# EasyEDA Pro project sata-3.3v-injector.eprj

# Schematic Schematic1
Board Name: Board1; Create Date: 2025-01-10; Page Name: P1; Project Name: sata-3.3v-injectior; Schematic Name: Schematic1; Update Date: 2025-01-11; Company: EasyEDA.com; Page Size: A4; Version: V1.0
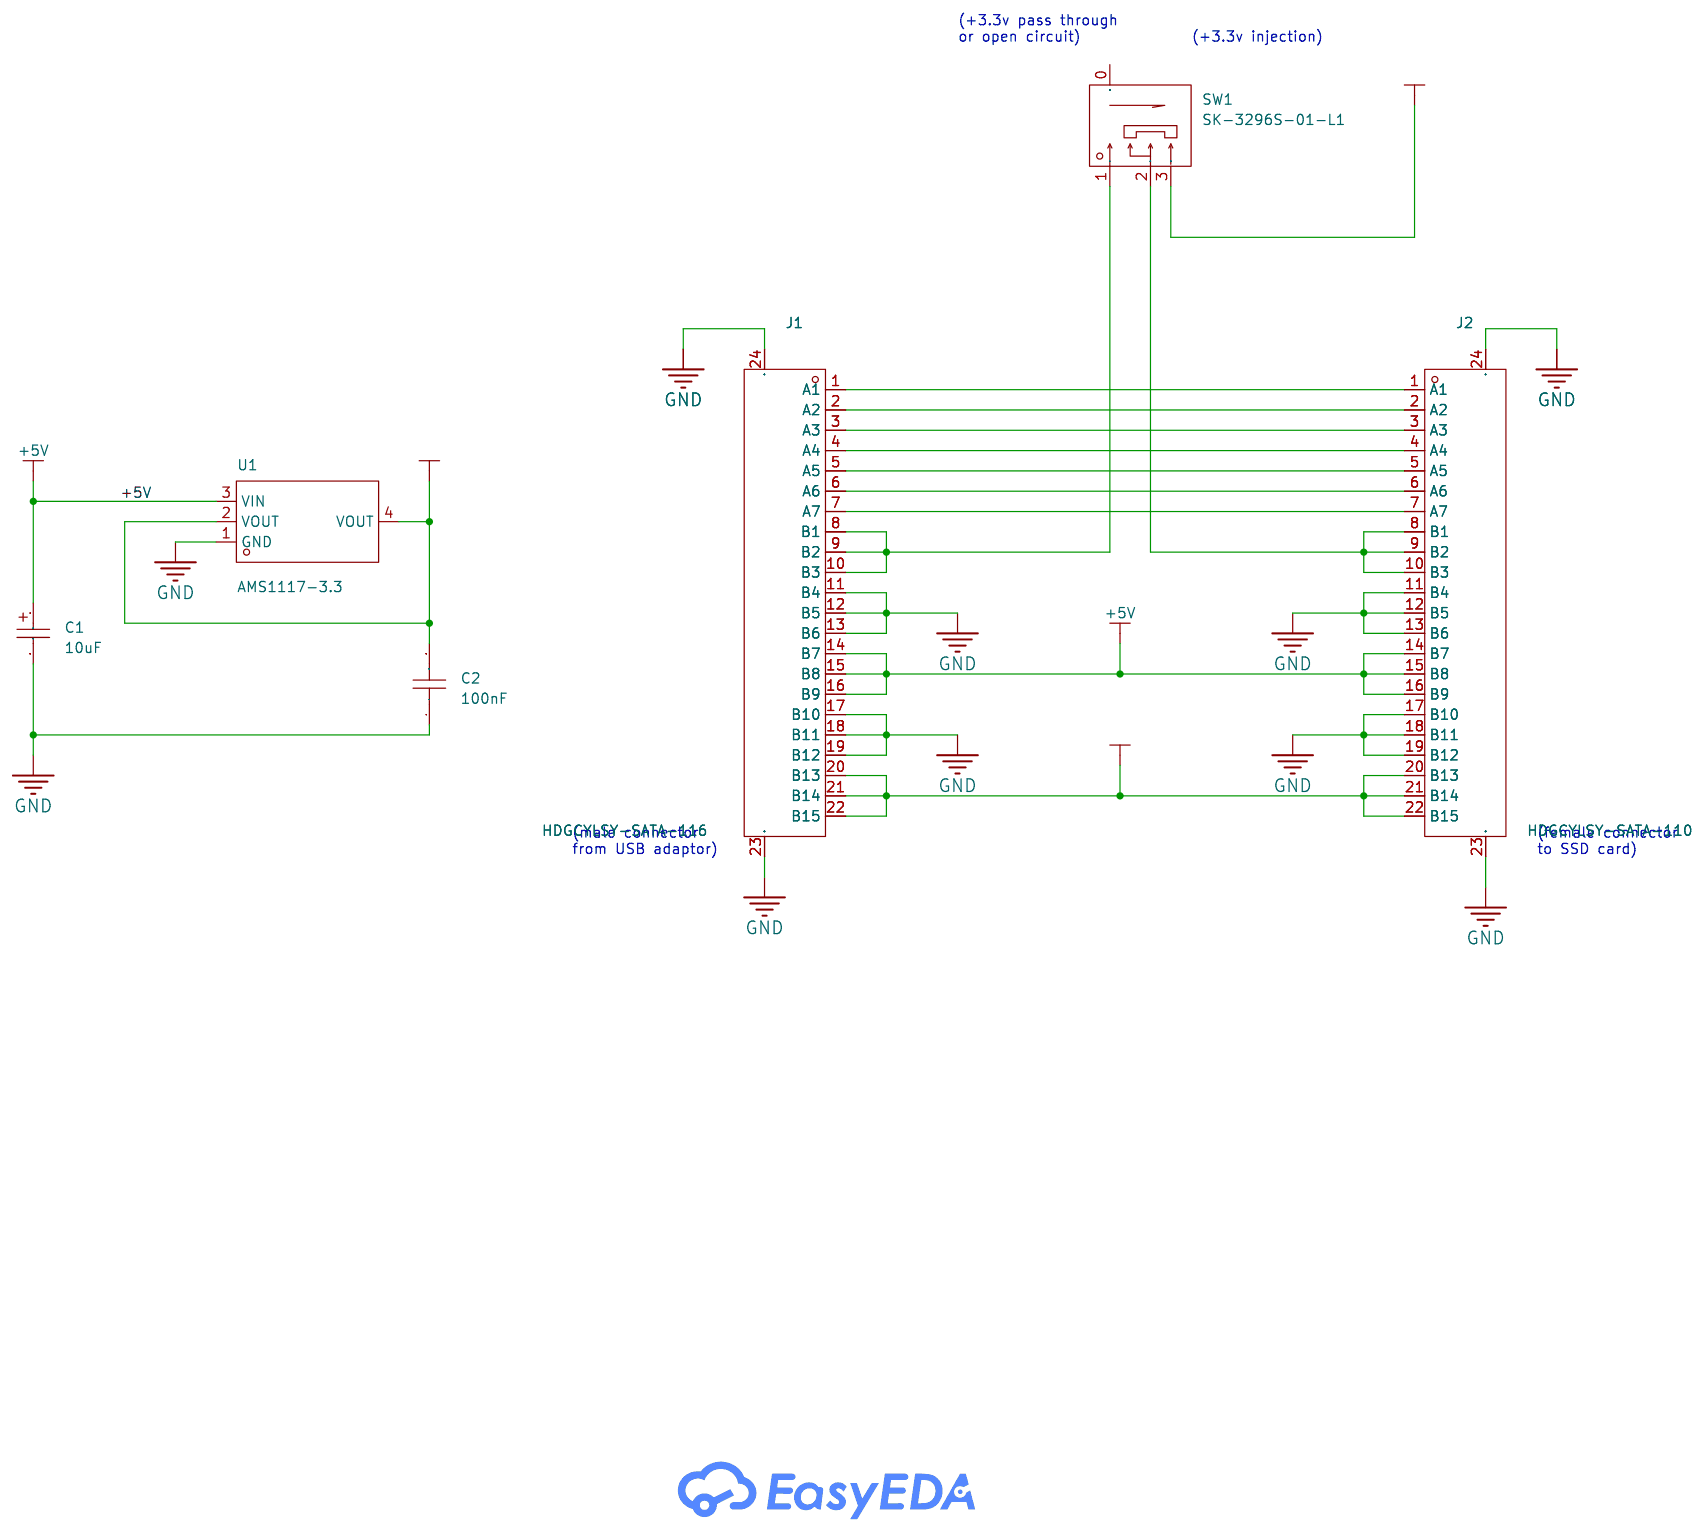
[diagram p0: schematic sheet]

## Parts
C1  10uF  [CAP-SMD_L3.2-W1.6-RD-C7171]
C2  100nF  [C1206]
J1  HDGCYLSY-SATA-116  [CONN-SMD_HDGCYLSY-SATA-116]
J2  HDGCYLSY-SATA-110  [CONN-TH_HDGCYLSY-SATA-110]
SW1  SK-3296S-01-L1  [SW-SMD_3P-P1.50_L2.7-W6.6]
U1  AMS1117-3.3  [SOT-223-3_L6.5-W3.4-P2.30-LS7.0-BR]

## Library data of the parts
C1 = TAJA106K016RNJ: LCSC Part Name: 10uF ±10% 16V; Supplier Part: C7171; Manufacturer: Kyocera AVX; Supplier Footprint: CASE-A-3216; JLCPCB Part Class: Basic Part; Datasheet: https://atta.szlcsc.com/upload/public/pdf/source/20160107/1457707750344.pdf; Supplier: LCSC; Tolerance: ±10%; Equivalent Series Resistance(ESR): 3Ω@100kHz; Operating Temperature: -55℃~+125℃
C2 = GCM31C5C1H104JA16L: LCSC Part Name: 100nF ±5%; Supplier Part: C882571; Manufacturer: muRata(村田); Supplier Footprint: 1206; JLCPCB Part Class: Extended Part; Datasheet: https://atta.szlcsc.com/upload/public/pdf/source/20201228/C882571_8A6F0C0C00D98315770AEDBC7A9A86E9.pdf; Supplier: LCSC; Tolerance: ±5%
J1 = HDGCYLSY-SATA-116: Supplier Part: C22438718; Manufacturer: HDGC(华德共创); Supplier Footprint: SMD; JLCPCB Part Class: Extended Part; Datasheet: https://atta.szlcsc.com/upload/public/pdf/source/20240523/831B0A3C81997D69A55E4CE07F3BF067.pdf; Supplier: LCSC
J2 = HDGCYLSY-SATA-110: Interface Form:SATA Connector Type:Female Connector Number of Pins:22P Mounting Style:Horizontal attachment Body Height:5mm Supplementary Features:Harpoon foot (metal)；With column Operating Temperature Range:- Operating Temperature Range:-; Supplier Part: C22438712; Manufacturer: HDGC(华德共创); Supplier Footprint: SMD; JLCPCB Part Class: Extended Part; Datasheet: https://atta.szlcsc.com/upload/public/pdf/source/20240523/F26935ADBD4A473DAFCB5F8DF03DABC5.pdf; Supplier: LCSC; Interface Form: SATA; Connector Type: Female Connector; Number of Pins: 22P; Mounting Style: Horizontal attachment; Body Height: 5mm; Supplementary Features: Harpoon foot (metal)；With column
SW1 = SK-3296S-01-L1: LCSC Part Name: 柄长1.5mm 卧贴双档 滑动开关; Supplier Part: C319020; Manufacturer: XKB Connectivity(中国星坤); Supplier Footprint: SMD; JLCPCB Part Class: Extended Part; Datasheet: https://atta.szlcsc.com/upload/public/pdf/source/20211011/33977E7F5E3AE40A3E3DC6795807E20F.pdf; Supplier: LCSC; Circuit: SPDT; Actuator Style: Rectangular columnar; Pin Style: SMDSplicing; Switch Length: 7.8mm; Switch Width: 2.75mm; Switch Height: 1.35mm; Mounting Style: 卧贴; Actuator Color: Black; Current Rating (DC): 50mA; Voltage Rating (DC): 12V; Current Rating (AC): 50mA; Voltage Rating (AC): 12V; Mechanical Life: 1万次; Operating Temperature: -40℃~+85℃
U1 = AMS1117-3.3_C6186: LCSC Part Name: 输出3.3V 1A; Supplier Part: C6186; Manufacturer: AMS; Supplier Footprint: SOT-223; JLCPCB Part Class: Basic Part; Datasheet: https://atta.szlcsc.com/upload/public/pdf/source/20180727/C6186_7A095716F0823C02F1997A905E26C086.pdf; Supplier: LCSC; Output Voltage: 3.3V; MAX Output Current: 1A; Power Supply Rejection Ratio (PSRR): 72dB@(120Hz); Dropout Voltage: 1.3V@(800mA); Output Polarity: Positive electrode; Number of Outputs: 1

## Nets
+3V3: C2.2 SW1.3 U1.2(VOUT) U1.4(VOUT)
+5V: C1.1 J1.14(B7) J1.15(B8) J1.16(B9) J2.14(B7) J2.15(B8) J2.16(B9) U1.3(VIN)
+12V: J1.20(B13) J1.21(B14) J1.22(B15) J2.20(B13) J2.21(B14) J2.22(B15)
GND: C1.2 C2.1 J1.11(B4) J1.12(B5) J1.13(B6) J1.17(B10) J1.18(B11) J1.19(B12) J1.23 J1.24 J2.11(B4) J2.12(B5) J2.13(B6) J2.17(B10) J2.18(B11) J2.19(B12) J2.23 J2.24 U1.1(GND)
$1N653: J1.8(B1) J1.9(B2) J1.10(B3) SW1.1
$1N727: J2.8(B1) J2.9(B2) J2.10(B3) SW1.2
$1N1878: J1.2(A2) J2.2(A2)
$1N1882: J1.3(A3) J2.3(A3)
$1N1896: J1.5(A5) J2.5(A5)
$1N1901: J1.6(A6) J2.6(A6)
Net-(J1-1): J1.1(A1) J2.1(A1)
Net-(J1-4): J1.4(A4) J2.4(A4)
Net-(J1-7): J1.7(A7) J2.7(A7)

Not connected (* = marked no-connect by the designer): SW1 0

## Notes on the sheet
- (+3.3v pass through
  or open circuit)
- (+3.3v injection)
- (male connector
  from USB adaptor)
- (female connector
  to SSD card)

# Board PCB1
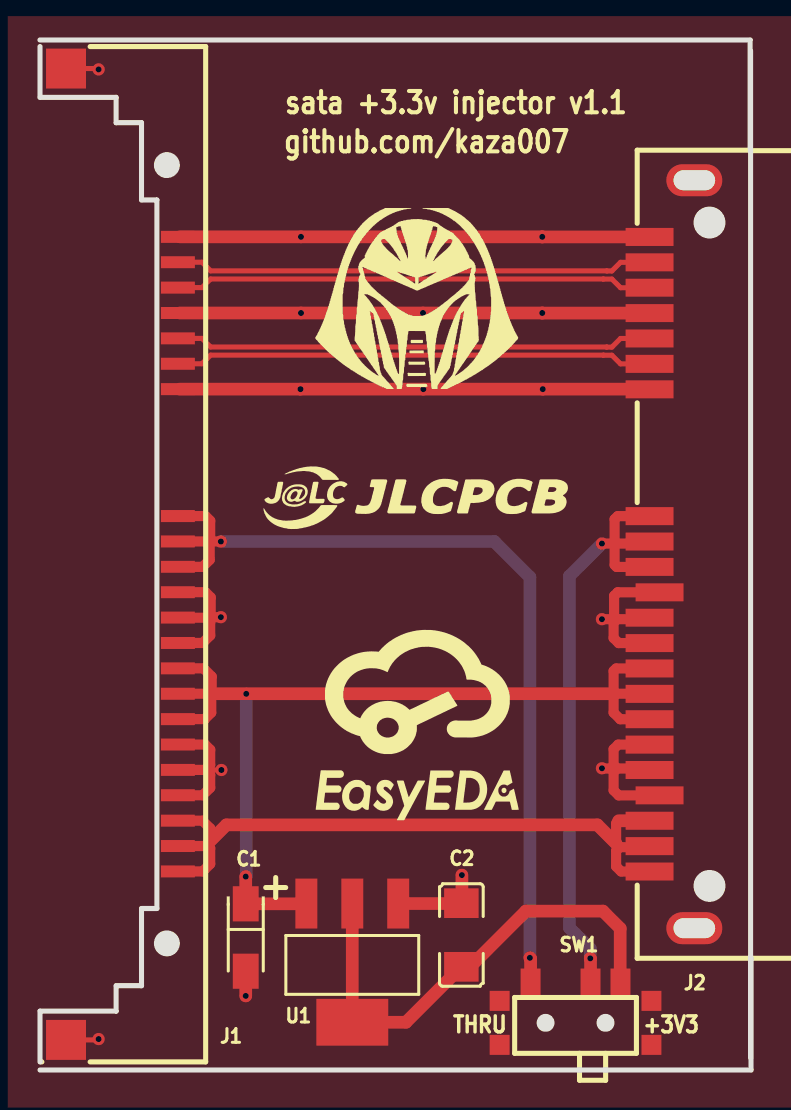
[diagram p1: board, top side]
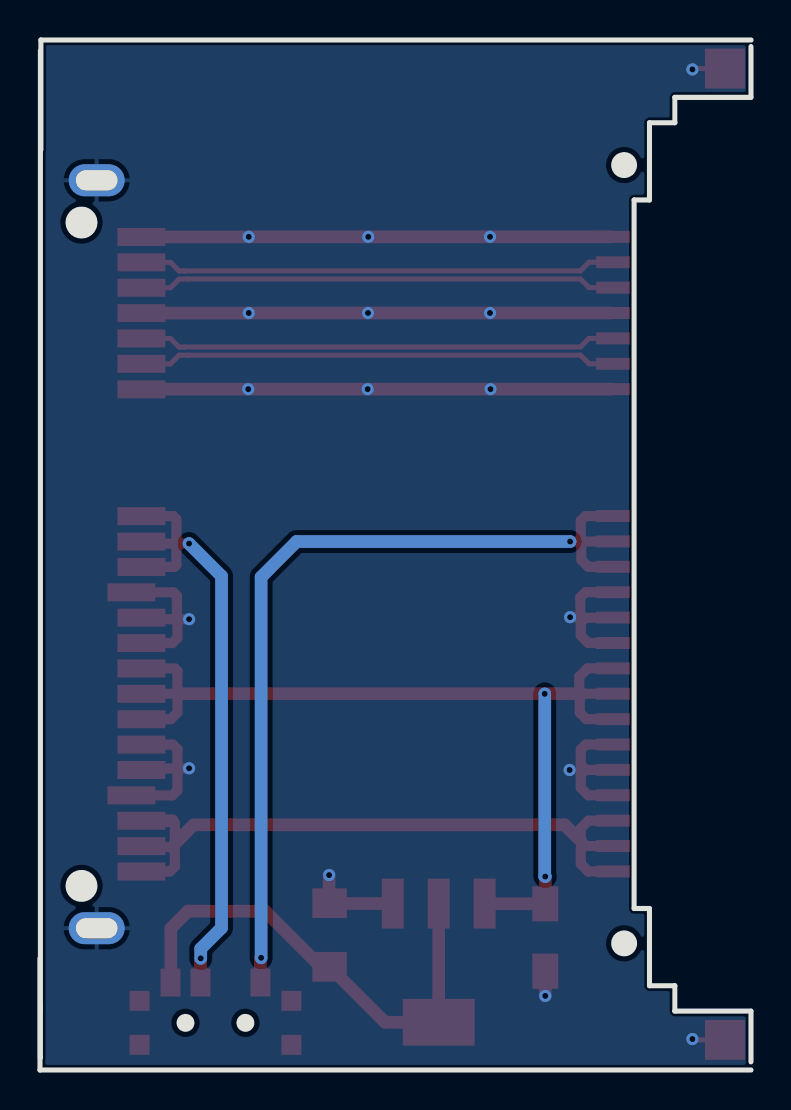
[diagram p2: board, bottom side, seen from below]

Outline 35.6 x 51.54 mm; copper layers: Top Layer, Bottom Layer. Coordinates in mm from the lower left corner of the outline.
Outline path: 0,51.54 35.55,51.54 35.55,46.02 ; 0,0 35.6,0 35.6,5.59
Stack: Top Layer 0.035mm / Dielectric1 1.51mm FR4 er 4.5 / Bottom Layer 0.035mm

## Design rules (mm)
net $1N1878: DP1
net $1N1882: DP1
net $1N1896: DP2
net $1N1901: DP2
template: Custom Config
spacing copperThickness1oz (default): track to track 0.102, other pairs 0.152 to 0.3
spacing copperThickness2oz: track to track 0.203, other pairs 0.152 to 0.3
track width copperThickness1oz (default): min 0.127, default 0.254, max 2.54
track width copperThickness2oz: min 0.203, default 0.254, max 2.54
differential pair differentialPair (default): width min 0.127, default 0.254, max 2.54; gap min 0.152, default 0.152
via viaSize (default): diameter min 0.5, default 0.61, max 10; hole min 0.3, default 0.305, max 6.3

## Placement (name value [footprint] x y rotation side)
C1  10uF  [CAP-SMD_L3.2-W1.6-RD-C7171]  10.3 6.63 270 top
C2  100nF  [C1206]  21.1 6.76 270 top
J1  HDGCYLSY-SATA-116  [CONN-SMD_HDGCYLSY-SATA-116]  4.1 25.81 90 top
J2  HDGCYLSY-SATA-110  [CONN-TH_HDGCYLSY-SATA-110]  31.64 25.81 90 top
SW1  SK-3296S-01-L1  [SW-SMD_3P-P1.50_L2.7-W6.6]  26.81 2.82 0 top
U1  AMS1117-3.3  [SOT-223-3_L6.5-W3.4-P2.30-LS7.0-BR]  15.64 5.36 90 top

## Footprints (pads in the part's own frame, mm; a bottom-side part is the same pattern mirrored in y, then rotated)
C1206
  rect 1.485x1.728 smd: 1(-1.593,0) 2(1.593,0)
CAP-SMD_L3.2-W1.6-RD-C7171
  rect 1.758x1.296 smd: 1(-1.687,0) 2(1.687,0)
CONN-SMD_HDGCYLSY-SATA-116
  rect 0.6x1.7 smd: 1(15.88,-2.8) 2(14.61,-2.8) 3(13.34,-2.8) 4(12.07,-2.8) 5(10.8,-2.8) 6(9.53,-2.8) 7(8.26,-2.8) 8(1.91,-2.8) 9(0.64,-2.8) 10(-0.63,-2.8) 11(-1.9,-2.8) 12(-3.17,-2.8) 13(-4.44,-2.8) 14(-5.71,-2.8) 15(-6.98,-2.8) 16(-8.25,-2.8) 17(-9.52,-2.8) 18(-10.79,-2.8) 19(-12.06,-2.8) 20(-13.33,-2.8) 21(-14.6,-2.8) 22(-15.87,-2.8)
  rect 2x2 smd: 23(-24.3,2.8) 24(24.3,2.8)
CONN-TH_HDGCYLSY-SATA-110
  rect 0.9x2.4 smd: 1(15.875,1.12) 2(14.605,1.12) 3(13.335,1.12) 4(12.065,1.12) 5(10.795,1.12) 6(9.525,1.12) 7(8.25,1.12) 8(1.905,1.12) 9(0.635,1.12) 10(-0.635,1.12) 11(-1.905,0.62) 12(-3.175,1.12) 13(-4.445,1.12) 14(-5.715,1.12) 15(-6.985,1.12) 16(-8.255,1.12) 17(-9.525,1.12) 18(-10.795,1.12) 19(-12.065,0.62) 20(-13.335,1.12) 21(-14.605,1.12) 22(-15.875,1.12)
  oval 1.6x2.8 hole 1x2.08: 23(-18.71,-1.12) 24(18.71,-1.12)
SOT-223-3_L6.5-W3.4-P2.30-LS7.0-BR
  rect 2.5x1.1 smd: 1(2.97,-2.3) 2(2.97,0) 3(2.97,2.3)
  rect 2.34x3.6 smd: 4(-2.97,0)
SW-SMD_3P-P1.50_L2.7-W6.6
  rect 1x1 smd: 0(-3.8,0.641) 0(-3.8,-1.559) 0(3.8,0.641) 0(3.8,-1.559)
  rect 1x1.4 smd: 1(-2.25,1.559) 2(0.75,1.559) 3(2.25,1.559)

## Nets
As in the schematic, except:
GND: C1.2 C2.1 J1.1 J1.4 J1.7 J1.11 J1.12 J1.13 J1.17 J1.18 J1.19 J1.23 J1.24 J2.1 J2.4 J2.7 J2.11 J2.12 J2.13 J2.17 J2.18 J2.19 J2.23 J2.24 U1.1

Pads without a net: SW1 0

## Via types
v1: diameter 0.61, hole 0.305, Top Layer to Bottom Layer, 23 vias

## Routing (per net, layer and track width the routed paths; a pad name or vN(x,y) marks a point on that pad's centre or on a via; arc(x,y) is an arc through that point)
+3V3: length 24.7
  Top Layer w0.635: U1.2 U1.4 18.32,2.39 C2.2 21.54,5.16 24.32,7.95 28.18,7.95 29.05,7.09 29.05,4.39 SW1.3
+5V: length 48.7
  Top Layer w0.508: 8.45,18.83 8.57,18.71 8.57,17.88 8.25,17.56 J1.16 ; 8.45,18.83 8.6,18.97 8.6,19.69 8.19,20.1 J1.14 ; 8.45,18.83 J1.15 ; 28.77,18.83 30.51,18.83 J2.15 ; 28.77,18.83 28.72,18.77 28.72,17.88 29.05,17.55 J2.16 ; 28.77,18.83 28.72,18.88 28.72,19.96 28.84,20.09 J2.14
  Top Layer w0.635: v1(10.3,9.68) C1.1 13.32,8.32 U1.3 ; 28.77,18.83 8.45,18.83
  Bottom Layer w0.635: v1(10.33,18.82) 10.33,9.7 v1(10.3,9.68)
+12V: length 35
  Top Layer w0.508: 7.01,11.21 8.27,11.21 8.34,11.28 ; 8.34,11.28 8.52,11.1 8.52,10.31 8.15,9.94 7.01,9.94 ; 8.34,11.28 8.52,11.46 8.52,12.09 8.14,12.48 7.01,12.48 ; 29.02,11.15 28.84,10.97 28.84,10.19 29.1,9.93 J2.22 ; 29.02,11.15 28.84,11.33 28.84,12.34 28.97,12.47 ; 29.02,11.15 30.47,11.15 J2.21
  Top Layer w0.635: J2.20 28.97,12.47 ; 8.52,11.46 9.33,12.27 27.91,12.27 28.84,11.33
GND: length 112.2
  Top Layer w0.254: v1(2.94,1.55) 2.89,1.51 1.41,1.51 ; v1(2.94,50.06) 2.89,50.11 1.41,50.11 ; v1(9.08,15.01) 8.28,15.01
  Top Layer w0.508: 8.56,22.58 8.64,22.66 9,22.66 9.01,22.66 v1(9.06,22.66) ; 8.56,22.58 8.34,22.58 ; 8.56,22.58 8.55,22.59 8.55,23.65 8.29,23.91 J1.11 ; 28.9,22.56 28.72,22.38 28.72,21.62 28.97,21.36 J2.13 ; 28.9,22.56 28.67,22.56 ; 28.9,22.56 30.44,22.56 J2.12 ; 8.34,22.58 8.52,22.4 8.52,21.74 8.15,21.37 7.01,21.37 ; 8.34,22.58 8.29,22.63 7.09,22.63 7.08,22.64 7.01,22.64 ; v1(28.13,15.1) 28.14,15.09 28.9,15.09 ; 7.01,16.29 8.26,16.29 8.52,16.03 8.52,15.27 8.27,15.02 ; J2.11 28.92,23.9 28.74,23.72 28.74,22.63 28.67,22.56 ; 8.27,15.02 7.01,15.02 ; 8.27,15.02 8.52,14.77 8.52,14.12 8.15,13.75 7.01,13.75 ; 28.9,15.09 28.72,14.91 28.72,14 28.97,13.74 J2.19 ; 28.9,15.09 30.44,15.09 J2.18 ; 28.9,15.09 28.72,15.27 28.72,16.05 28.95,16.28 J2.17 ; 28.67,22.56 28.13,22.56 v1(28.13,22.56)
  Top Layer w0.635: J2.4 25.15,37.87 v1(25.14,37.88) v1(19.17,37.88) v1(13.07,37.88) 7.01,37.88 ; 7.01,34.07 v1(13.04,34.07) v1(19.19,34.07) v1(25.17,34.07) 30.51,34.07 J2.7 ; C2.1 21.08,8.33 U1.1 ; C1.2 v1(10.3,3.71) ; 7.01,41.69 v1(13.07,41.69) v1(19.16,41.69) v1(25.14,41.69) 25.15,41.68 J2.1 ; v1(21.12,9.75) 21.12,8.37
$1N653: length 44
  Top Layer w0.508: v1(9.06,26.44) 9.05,26.45 8.51,26.45 ; 8.51,26.45 7.01,26.45 ; 8.51,26.45 8.52,26.46 8.52,27.48 8.29,27.72 J1.8 ; 8.5,26.44 8.5,25.53 8.15,25.18 J1.10
  Top Layer w0.635: v1(24.53,5.61) 24.56,5.58 SW1.1
  Bottom Layer w0.635: v1(24.53,5.61) 24.53,24.66 22.75,26.44 v1(9.06,26.44)
$1N727: length 31.4
  Top Layer w0.508: 28.82,26.34 30.42,26.34 J2.9 ; 28.82,26.34 28.77,26.29 28.77,25.27 28.87,25.17 J2.10 ; 28.82,26.34 v1(28.13,26.34) ; 28.82,26.34 28.77,26.39 28.77,27.56 28.92,27.71 J2.8
  Top Layer w0.635: SW1.2 27.56,5.57 v1(27.55,5.59)
  Bottom Layer w0.635: v1(27.55,5.59) 27.55,6.07 26.51,7.11 26.51,24.71 v1(28.13,26.34)
$1N1878: length 23.9
  Top Layer w0.254: J2.2 29.06,40.41 28.63,39.98 28.38,39.98 28.37,39.98 8.54,39.98 8.11,40.42 7.01,40.42
$1N1882: length 23.9
  Top Layer w0.254: J2.3 29.06,39.14 28.63,39.57 28.21,39.57 28.2,39.58 8.54,39.58 8.11,39.15 7.01,39.15
$1N1896: length 23.9
  Top Layer w0.254: 7.01,36.61 8.11,36.61 8.54,36.17 28.37,36.17 28.38,36.17 28.63,36.17 29.06,36.6 J2.5
$1N1901: length 23.9
  Top Layer w0.254: 7.01,35.34 8.11,35.34 8.54,35.77 28.2,35.77 28.21,35.76 28.63,35.76 29.06,35.33 J2.6

## Copper pours and planes (outline as drawn; the poured copper is in the pictures)
GND on Top Layer: -1.61,52.73 37.76,52.73 37.76,-1.88 -1.61,-1.88
GND on Bottom Layer: -5.14,56.97 43.42,56.97 43.42,-6.78 -5.14,-6.78

## Text on the board
Top Silkscreen Layer: THRU | +3V3 | github.com/kaza007 | sata +3.3v injector v1.1
